# EAGLE design [B]Sensor_Board_Digital_v1.2 (EAGLE 7.1.0)
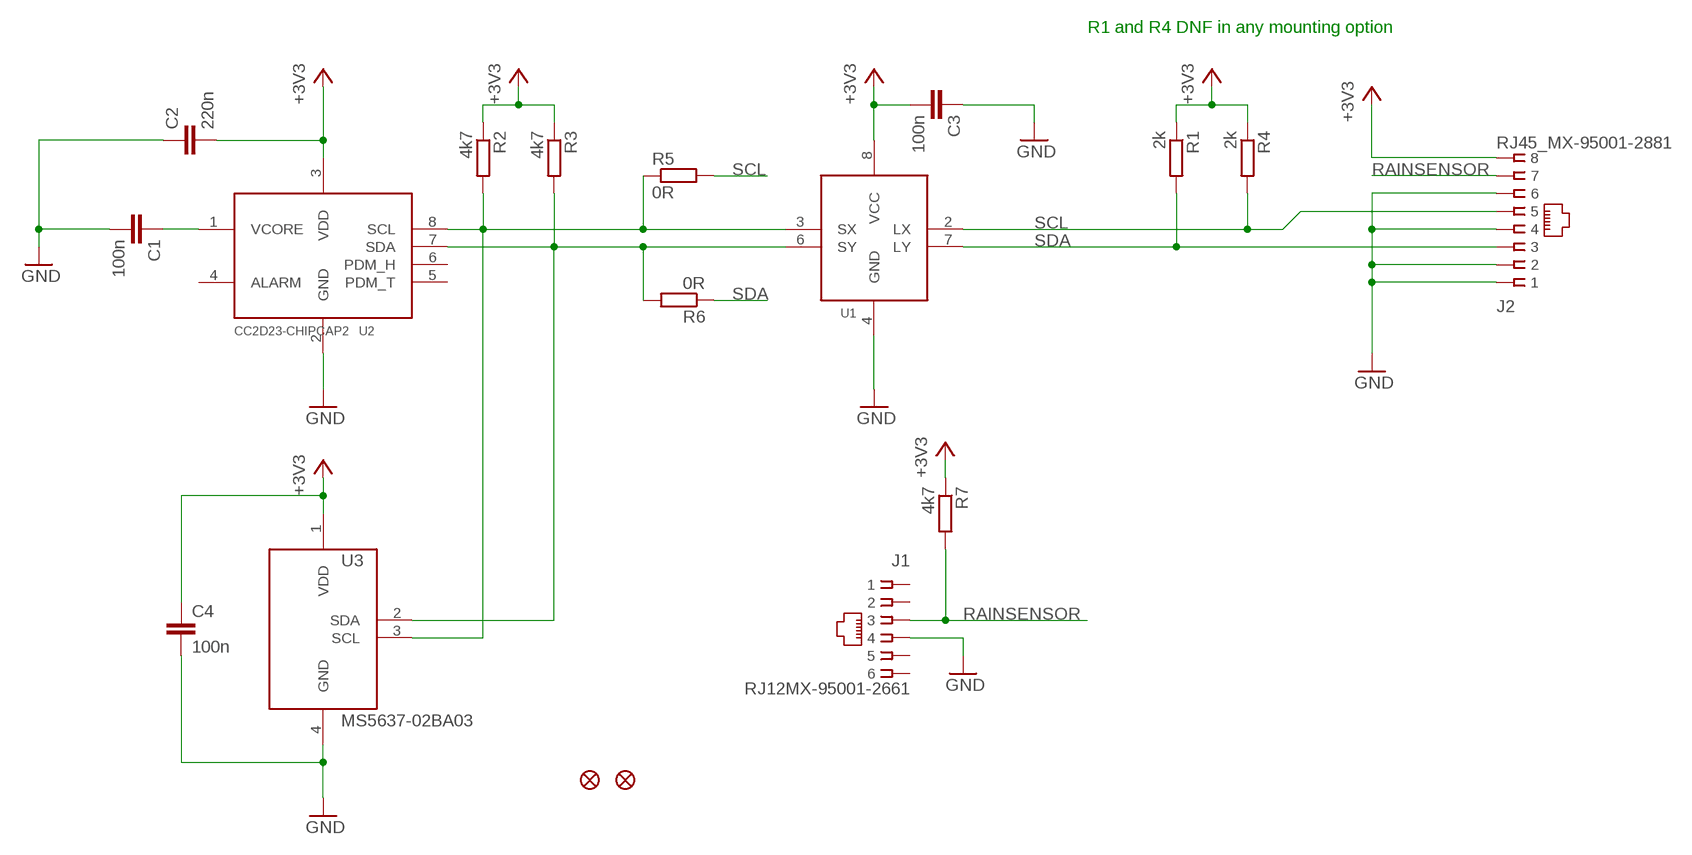
[diagram p0: schematic, sheet 1]

## Parts
C1  100n  C-EUC1206  [C1206]
C2  220n  C-EUC1206  [C1206]
C3  100n  C-EUC1206  [C1206]
C4  100n  C-EUC1206  [C1206]
J1  RJ12MX-95001-2661  [MX-95001-2661]
J2  RJ45_MX-95001-2881  [MX-95001-2881]
JP1  FIDUCIALUFIDUCIAL  [MICRO-FIDUCIAL]
JP2  FIDUCIALUFIDUCIAL  [MICRO-FIDUCIAL]
R1  2k  R-EU_R1206  [R1206]
R2  4k7  R-EU_R1206  [R1206]
R3  4k7  R-EU_R1206  [R1206]
R4  2k  R-EU_R1206  [R1206]
R5  0R  R-EU_R1206  [R1206]
R6  0R  R-EU_R1206  [R1206]
R7  4k7  R-EU_R1206  [R1206]
U1  P82B715_I2C_BUS_EXTENDER  [SO-08]
U2  CC2D23-CHIPCAP2  [CC2D23-CHIPCAP2]
U3  MS5637-02BA03  [MS5637-02BA03]

## Nets
+3V3: C2.2 C3.2 C4.1 J2.8 R1.1 R2.1 R3.1 R4.1 R7.1 U1.8(VCC) U2.3(VDD) U3.1(VDD)
GND: C1.2 C2.1 C3.1 C4.2 J1.4 J2.1 J2.2 J2.4 J2.6 U1.4(GND) U2.2(GND) U3.4(GND)
N$1: C1.1 U2.1(VCORE)
N$4: R2.2 R5.1 U1.3(SX) U2.8(SCL) U3.3(SCL)
N$6: R3.2 R6.2 U1.6(SY) U2.7(SDA) U3.2(SDA)
RAINSENSOR: J1.3 J2.7 R7.2
SCL: J2.5 R4.2 R5.2 U1.2(LX)
SDA: J2.3 R1.2 R6.1 U1.7(LY)
Unconnected: J1.1 J1.2 J1.5 J1.6 U2.4(ALARM) U2.5(PDM_T) U2.6(PDM_H)

## Notes on the sheet
- R1 and R4 DNF in any mounting option

## Library data of the parts
C1-C4 = rcl:C-EU: CAPACITOR, European symbol
J1 = Thomas Egnal Library:RJ12: CORCOM Modular RJ Jacks No Shield Source: https://www.elfa.se/elfa3~se_sv/elfa/init.do?item=42-696-27&toc=0&q=42-696-27; LINK: http://www.tme.eu/pl/katalog/?idp=1&search=mx-95001-2661&cleanParameters=1; VENDOR: TME
J2 = Thomas Egnal Library:RJ45; LINK: http://www.tme.eu/pl/details/mx-95501-2881/zlacza-rj/molex/95501-2881/; VENDOR: TME
JP1 JP2 = SparkFun:FIDUCIAL: Fiducial Alignment Points Various fiducial points for machine vision alignment.
R1-R7 = rcl:R-EU_: RESISTOR, European symbol
U1 = Thomas Egnal Library:P82B715_I2C_BUS_EXTENDER
U2 = Thomas Egnal Library:CC2D23-CHIPCAP2
U3 = Thomas Egnal Library:MS5637-02BA03: Board Mount Pressure Sensors Low Volt Barometric Pressure Sensor; LINK: http://pl.mouser.com/ProductDetail/Measurement-Specialties-Inc/MS563702BA03-50/?qs=sGAEpiMZZMueJGT%2f0PGc46kcmVgvYutEz7IcONe7VTY%3d; VENDOR: MOUSER

## Board
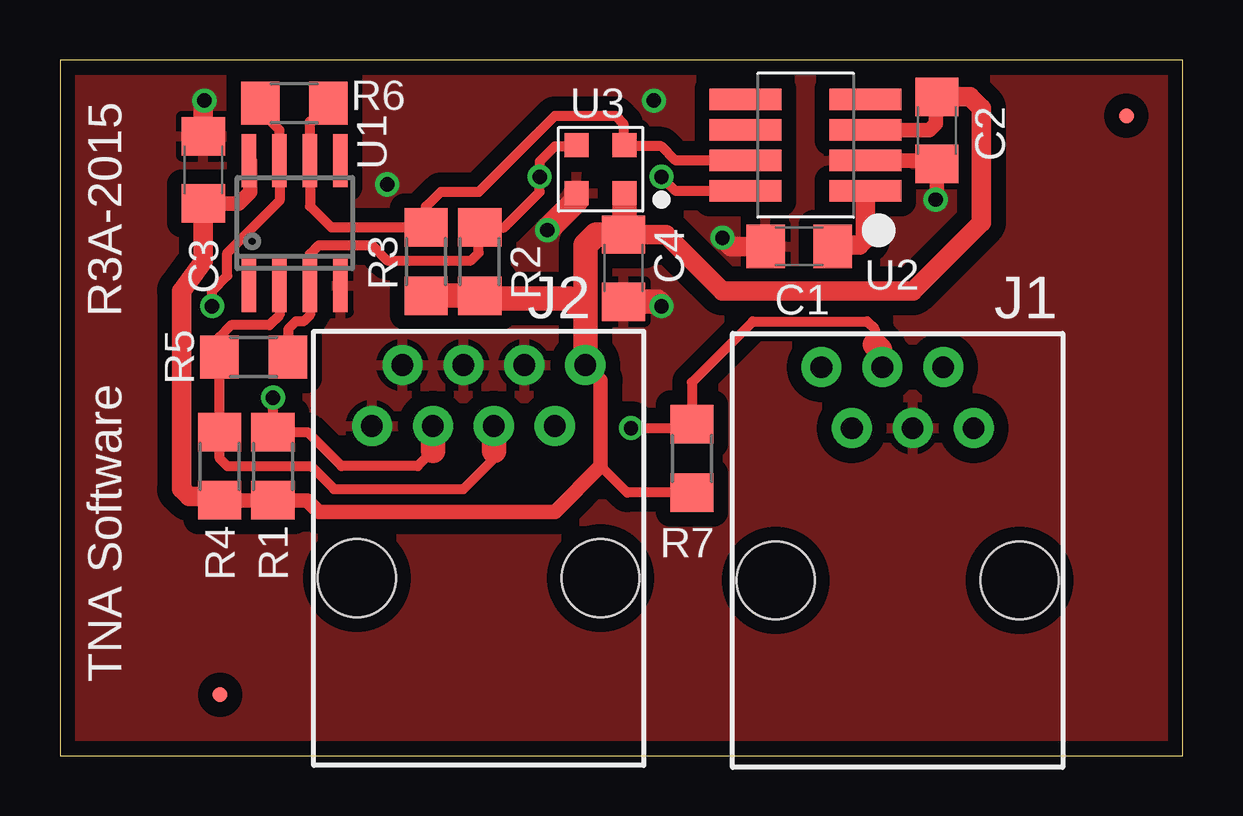
[diagram p1: board, top side]
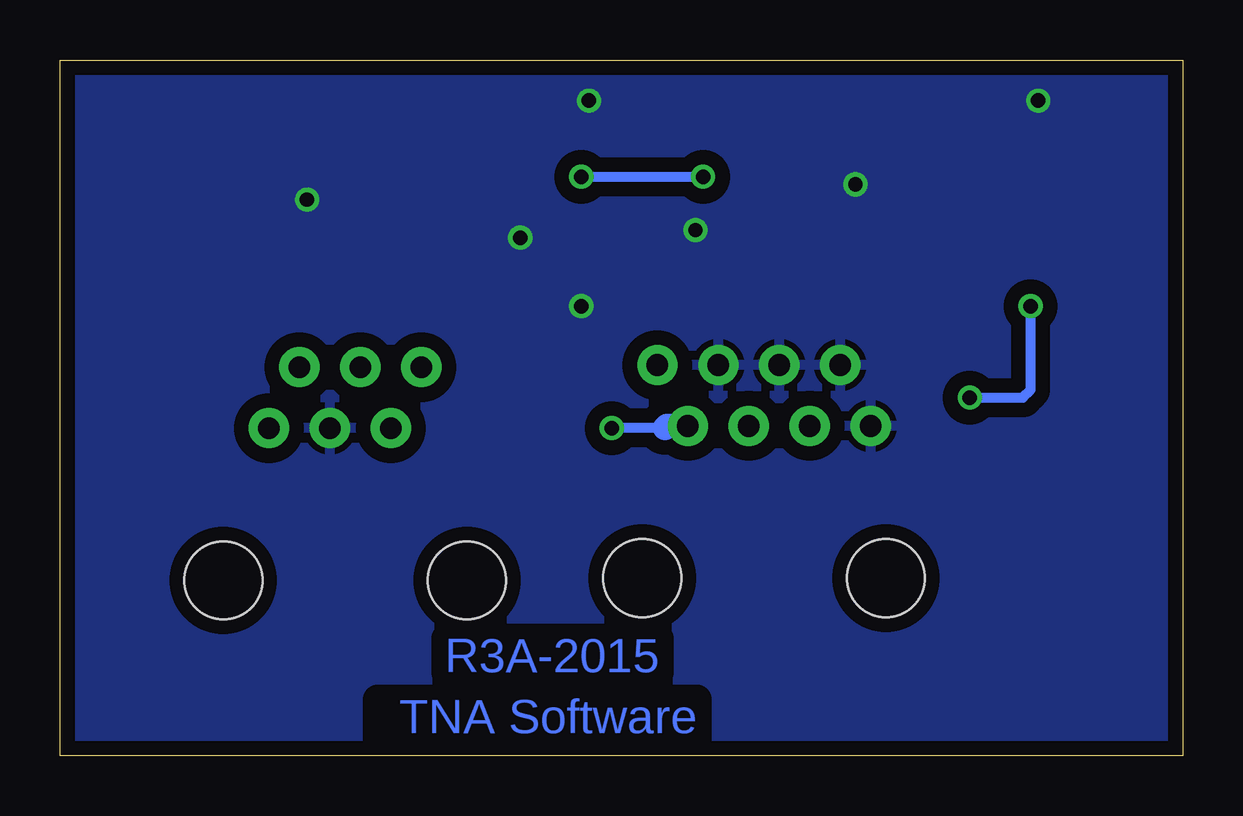
[diagram p2: board, bottom side, seen from below]

Size 46.8 x 29 mm. Coordinates in mm from the lower left corner, seen from the top.
Outline: 0,0 46.8,0 46.8,29 0,29 0,0
Copper layers (1*16): Top 0.0356mm / dielectric 1.5011mm / Bottom 0.0356mm
Design rules "default": minimum track width 7mil, minimum drill 14mil, track to track 7mil, track to pad 7mil, pad to pad 7mil, via to via 7mil, smd to smd 0mil, copper to edge 20mil, drill to drill 8mil, minimum pad ring 10mil, minimum via ring 8mil, stop-mask expansion 4mil, vias tented up to drill 0mil, thermal gap 10mil

### Footprints (pad centres in the part's own frame; a part is rotated, then mirrored left to right if it is on the bottom)
C1206 = smd 1.6 x 1.8: 1 -1.4,0; 2 1.4,0
MX-95001-2661 = drill 0.9 pad 1.676: 1 -3.175,8.89; 2 -1.905,6.35; 3 -0.635,8.89; 4 0.635,6.35; 5 1.905,8.89; 6 3.175,6.35 | hole 3.251: -5.08,0; 5.08,0
MX-95001-2881 = drill 0.9 pad 1.676: 1 -4.445,6.35; 2 -3.175,8.89; 3 -1.905,6.35; 4 -0.635,8.89; 5 0.635,6.35; 6 1.905,8.89; 7 3.175,6.35; 8 4.445,8.89 | hole 3.251: -5.08,0; 5.08,0
MICRO-FIDUCIAL = smd 0.635 x 0.635: 1 0,0
R1206 = smd 1.6 x 1.803: 1 -1.422,0; 2 1.422,0
SO-08 = smd 0.6 x 2.2: 1 -1.905,-2.6; 2 -0.635,-2.6; 3 0.635,-2.6; 4 1.905,-2.6; 5 1.905,2.6; 6 0.635,2.6; 7 -0.635,2.6; 8 -1.905,2.6
CC2D23-CHIPCAP2 = smd 3 x 0.9: 1 -2.5,1.905; 2 -2.5,0.635; 3 -2.5,-0.635; 4 -2.5,-1.905; 5 2.5,-1.905; 6 2.5,-0.635; 7 2.5,0.635; 8 2.5,1.905
MS5637-02BA03 = smd 1 x 1: 1 -1,1; 2 -1,-1; 3 1,-1; 4 1,1

### Placement (x,y rotation side)
C1  30.82,21.23 180 top
C2  36.55,26.06 90 top
C3  5.98,24.42 270 top
C4  23.48,20.32 270 top
J1  34.91,7.3 0 top
J2  17.45,7.39 0 top
JP1  6.67,2.54 0 top
JP2  44.45,26.67 0 top
R1  8.88,12.06 90 top
R2  17.5,20.59 90 top
R3  15.26,20.59 90 top
R4  6.66,12.06 90 top
R5  8.07,16.62 180 top
R6  9.77,27.19 0 top
R7  26.34,12.38 90 top
U1  9.79,22.2 0 top
U2  31.08,25.45 180 top
U3  22.53,24.45 180 top

### Tracks (layer width: path | path; a pad name or v marks a point on that pad's centre or on a via)
+3V3
  Top 0.406: R7.1 23.64,10.96 22.53,12.06
  Top 0.61: J2.8 22.53,15.64 22.53,12.06 20.63,10.16 10.79,10.16 10.3,10.64 R1.1 R4.1 | U2.3 36.23,26.08 36.5,26.35 36.5,27.42 C2.2 | C3.2 7.45,23.02 7.93,23.5 7.93,24.75 U1.8
  Top 0.813: C3.2 5.98,20.59 5.07,19.37 5.07,11.11 5.39,10.79 6.19,10.79 R4.1 | C2.2 37.93,27.46 38.41,26.99 38.41,22.23 35.55,19.37 27.61,19.37 25.26,21.72 C4.1
  Top 1.016: R3.1 R2.1 17.62,19.05 21.26,19.05 21.9,18.41 J2.8 21.9,21.27 22.34,21.72 C4.1 23.53,21.77 U3.1
GND  (via drill 0.6)
  Top 0.61: v36.5,23.18 36.55,23.22 C2.1 36.4,24.81 U2.2
  Top 0.813: C3.1 5.98,27.26 v6.02,27.3 | C1.2 27.98,21.23 v27.61,21.59
  Top 1.016: U3.4 21.53,23.13 v20.31,21.91 | C4.2 24.89,18.92 v25.07,18.73
  other vias: 24.75,27.3 13.64,23.81
  pour Bottom (isolate 0.61, rank 2): 0.18,29.03 0.18,0.02 47.77,0.02 47.77,29.03
  pour Top (isolate 0.61, rank 2): 0.18,29.03 0.18,0.02 47.77,0.02 47.77,29.03
N$1
  Top 0.813: U2.1 33.58,21.52 33.33,21.27 32.26,21.27 C1.1
N$4  (via drill 0.6)
  Top 0.406: R5.1 9.52,16.64 9.52,17.78 9.83,18.1 10.15,18.1 10.42,18.37 U1.3 10.42,20.91 10.79,21.27 13.01,21.27 13.64,20.64 17.14,20.64 17.45,20.95 17.45,21.97 R2.2 18.51,22.02 19.99,23.5 v19.99,24.13 19.99,24.77 20.63,25.4 21.48,25.4 U3.3 | U2.8 25.66,23.54 v25.07,24.13
  Bottom 0.406: v25.07,24.13 v19.99,24.13
N$6
  Top 0.406: R6.2 10.42,26.43 U1.6 10.42,22.91 11.31,22.02 R3.2 15.26,22.89 15.87,23.5 17.45,23.5 20.63,26.67 23.17,26.67 23.48,26.35 23.48,25.5 U3.2 23.58,25.4 25.07,25.4 25.66,24.81 U2.7
RAINSENSOR  (via drill 0.6)
  Top 0.406: v23.8,13.65 26.19,13.65 R7.2 26.34,15.56 28.88,18.1 33.65,18.1 33.96,17.78 33.96,17.14 | 34.19,16.92 34.28,16.92 J1.3
  Top 1.016: 34.19,16.92 33.96,17.14
  Bottom 0.406: 21.58,13.65 v23.8,13.65
  Bottom 1.016: J2.7 21.49,13.74 21.58,13.65
SCL
  Top 0.406: 18.09,12.7 18.09,12.38 16.82,11.11 11.42,11.11 10.47,12.06 6.97,12.06 6.66,12.38 R4.2 6.66,16.45 R5.2 6.65,17.46 7.13,17.94 8.72,17.94 9.15,18.37 U1.2
  Top 1.016: J2.5 18.09,12.7
SDA  (via drill 0.6)
  Top 0.406: 15.55,12.7 14.91,12.06 11.74,12.06 10.32,13.49 R1.2 v8.88,14.92 | v6.34,18.73 6.34,19.37 6.97,20 6.97,20.95 9.15,23.13 U1.7 9.15,26.08 8.88,26.35 8.88,26.66 R6.1
  Top 1.016: J2.3 15.55,12.7
  Bottom 0.406: v8.88,14.92 6.66,14.92 6.34,15.24 v6.34,18.73

### Text on the board
Bottom: R3A-2015 | TNA Software
tPlace: R3A-2015 | TNA Software